# Altium schematic sheet Badge.SchDoc
size A4
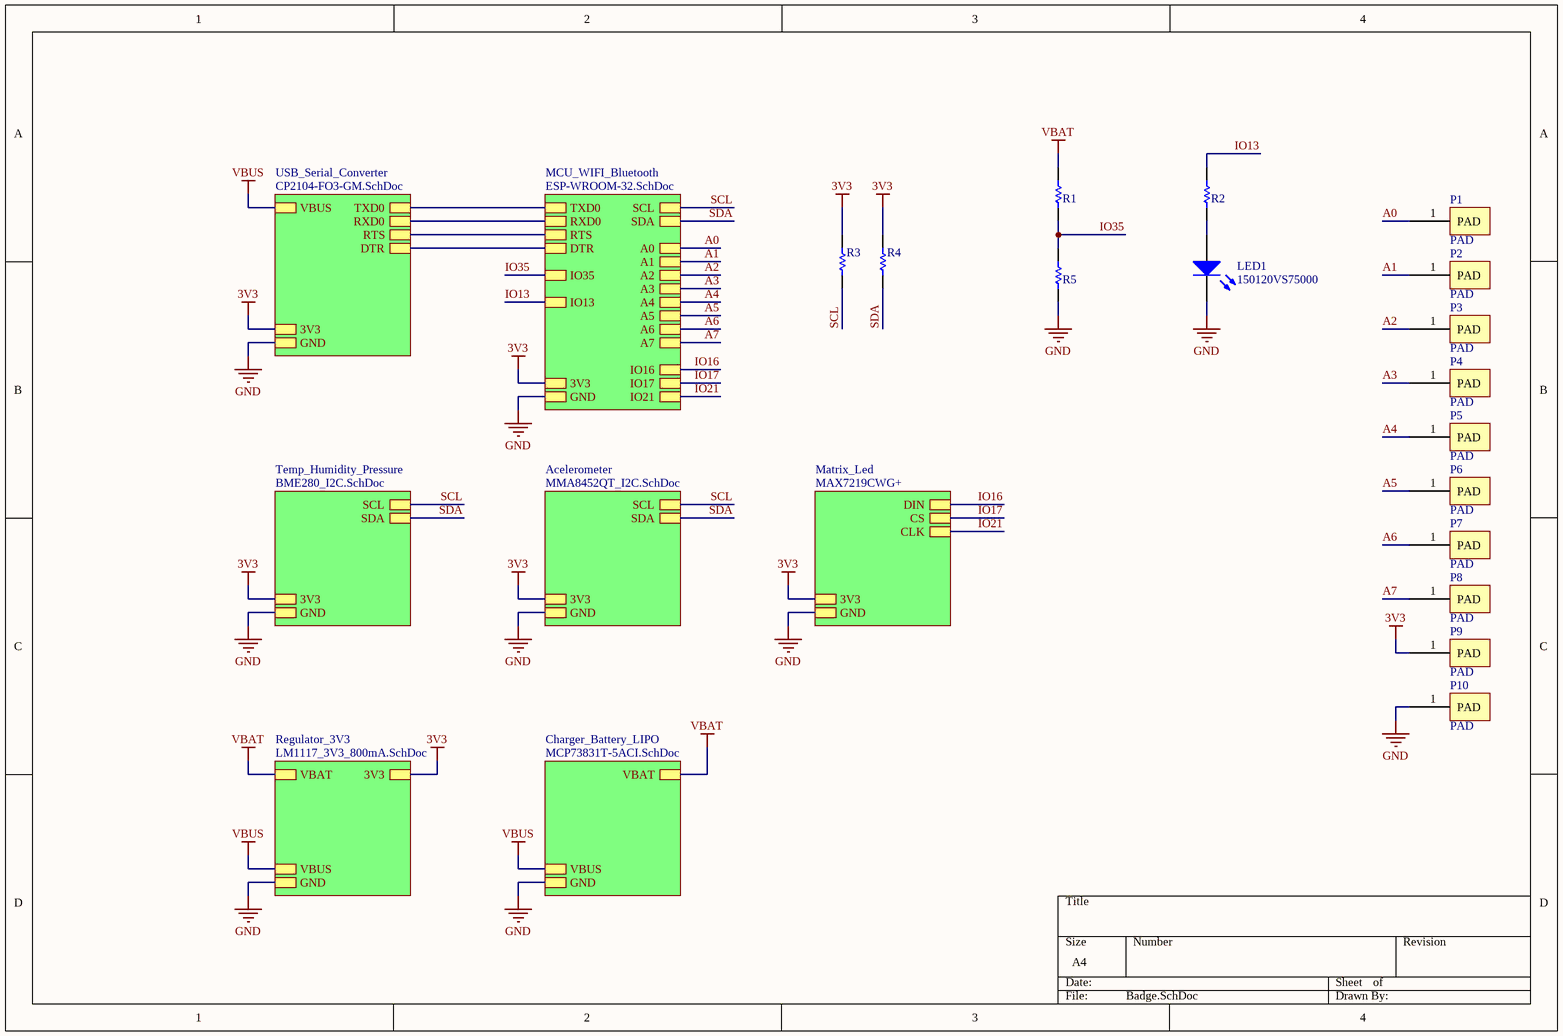
[diagram p0: Badge.SchDoc]

## Parts
LED1  150120VS75000  [1206_A]
P1  PAD  [Pad_C]
P2  PAD  [Pad_C]
P3  PAD  [Pad_C]
P4  PAD  [Pad_C]
P5  PAD  [Pad_C]
P6  PAD  [Pad_C]
P7  PAD  [Pad_C]
P8  PAD  [Pad_C]
P9  PAD  [Pad_C]
P10  PAD  [Pad_C]
R1  ERA6AEB104V  [RESC2013X60X40NL20T25]  (value not drawn)
R2  ERJ-P06J102V  [RESC2013X70X40NL20T20]  (value not drawn)
R3  RK73B2ATTD103J  [RESC2013X60X30NL20T20]  (value not drawn)
R4  RK73B2ATTD103J  [RESC2013X60X30NL20T20]  (value not drawn)
R5  ERA6AEB104V  [RESC2013X60X40NL20T25]  (value not drawn)

## Sub-sheets
Acelerometer = MMA8452QT_I2C.SchDoc: SDA, SCL, GND, 3V3
Charger_Battery_LIPO = MCP73831T-5ACI.SchDoc: GND, VBUS, VBAT
Matrix_Led = MAX7219CWG+: DIN, CS, CLK, 3V3, GND
MCU_WIFI_Bluetooth = ESP-WROOM-32.SchDoc: RTS, GND, RXD0, 3V3, SDA, DTR, TXD0, SCL, IO16, IO13, IO17, A2, A1, IO35, IO21, A7, A0, A3, A6, A4, A5
Regulator_3V3 = LM1117_3V3_800mA.SchDoc: 3V3, GND, VBUS, VBAT
Temp_Humidity_Pressure = BME280_I2C.SchDoc: GND, SDA, SCL, 3V3
USB_Serial_Converter = CP2104-FO3-GM.SchDoc: TXD0, DTR, RTS, RXD0, VBUS, 3V3, GND

## Nets
3V3: P9.1(PAD) R3.2 R4.2 ; sheet USB_Serial_Converter/3V3, sheet MCU_WIFI_Bluetooth/3V3, sheet Acelerometer/3V3, sheet Temp_Humidity_Pressure/3V3, sheet Regulator_3V3/3V3, sheet Matrix_Led/3V3
GND: LED1.1(K) P10.1(PAD) R5.1 ; sheet USB_Serial_Converter/GND, sheet MCU_WIFI_Bluetooth/GND, sheet Acelerometer/GND, sheet Temp_Humidity_Pressure/GND, sheet Regulator_3V3/GND, sheet Matrix_Led/GND, sheet Charger_Battery_LIPO/GND
VBAT: R1.2 ; sheet Regulator_3V3/VBAT, sheet Charger_Battery_LIPO/VBAT
VBUS: sheet USB_Serial_Converter/VBUS, sheet Regulator_3V3/VBUS, sheet Charger_Battery_LIPO/VBUS
A0: P1.1(PAD) ; sheet MCU_WIFI_Bluetooth/A0
A1: P2.1(PAD) ; sheet MCU_WIFI_Bluetooth/A1
A2: P3.1(PAD) ; sheet MCU_WIFI_Bluetooth/A2
A3: P4.1(PAD) ; sheet MCU_WIFI_Bluetooth/A3
A4: P5.1(PAD) ; sheet MCU_WIFI_Bluetooth/A4
A5: P6.1(PAD) ; sheet MCU_WIFI_Bluetooth/A5
A6: P7.1(PAD) ; sheet MCU_WIFI_Bluetooth/A6
A7: P8.1(PAD) ; sheet MCU_WIFI_Bluetooth/A7
IO13: R2.2 ; sheet MCU_WIFI_Bluetooth/IO13
IO16: sheet MCU_WIFI_Bluetooth/IO16, sheet Matrix_Led/DIN
IO17: sheet MCU_WIFI_Bluetooth/IO17, sheet Matrix_Led/CS
IO21: sheet MCU_WIFI_Bluetooth/IO21, sheet Matrix_Led/CLK
IO35: R1.1 R5.2 ; sheet MCU_WIFI_Bluetooth/IO35
SCL: R3.1 ; sheet MCU_WIFI_Bluetooth/SCL, sheet Acelerometer/SCL, sheet Temp_Humidity_Pressure/SCL
SDA: R4.1 ; sheet MCU_WIFI_Bluetooth/SDA, sheet Acelerometer/SDA, sheet Temp_Humidity_Pressure/SDA
NetLED1_2: LED1.2(A) R2.1
(unnamed): sheet USB_Serial_Converter/TXD0, sheet MCU_WIFI_Bluetooth/TXD0
(unnamed): sheet USB_Serial_Converter/DTR, sheet MCU_WIFI_Bluetooth/DTR
(unnamed): sheet USB_Serial_Converter/RTS, sheet MCU_WIFI_Bluetooth/RTS
(unnamed): sheet USB_Serial_Converter/RXD0, sheet MCU_WIFI_Bluetooth/RXD0

## Library data of the parts
LED1 = CMP-1426-00016-1: SMD mono-color Chip LED, WL-SMCW, Bright Green; Manufacturer: Wuerth Elektronik; ComponentLink2URL: http://katalog.we-online.com/led/datasheet/150120VS75000.pdf; PartNumber: 150120VS75000; Color: Bright Green; ComponentLink2Description: Datasheet; ComponentLink1URL: http://www.we-online.com; PackageReference: 1206_A; ComponentLink1Description: Manufacturer URL
P1-P10 = PAD: PAD 2mm
R1 R5 = CMP-2001-00583-1: 100 kOhms ±0.1% 0.125W, 1/8W Chip Resistor 0805 (2012 Metric) Automotive AEC-Q200 Thin Film; Manufacturer: Panasonic; Part Number: ERA6AEB104V
R2 = CMP-2001-00477-1: RES SMD 1K OHM 5% 1/2W 0805; Manufacturer: Panasonic; Part Number: ERJ-P06J102V
R3 R4 = CMP-2001-04657-1: 10 kOhms ±5% 0.25W, 1/4W Chip Resistor 0805 (2012 Metric) Automotive AEC-Q200, Moisture Resistant Thick Film; Manufacturer: KOA Speer; Part Number: RK73B2ATTD103J